# Altium schematic sheet top.SchDoc: uSDR schematic
size Letter; Author: Ye-sheng Kuo; CompanyName: Univ. of Michigan; DrawnBy: Ye-sheng Kuo; Revision: 2.0; SheetNumber: 1; SheetTotal: 16
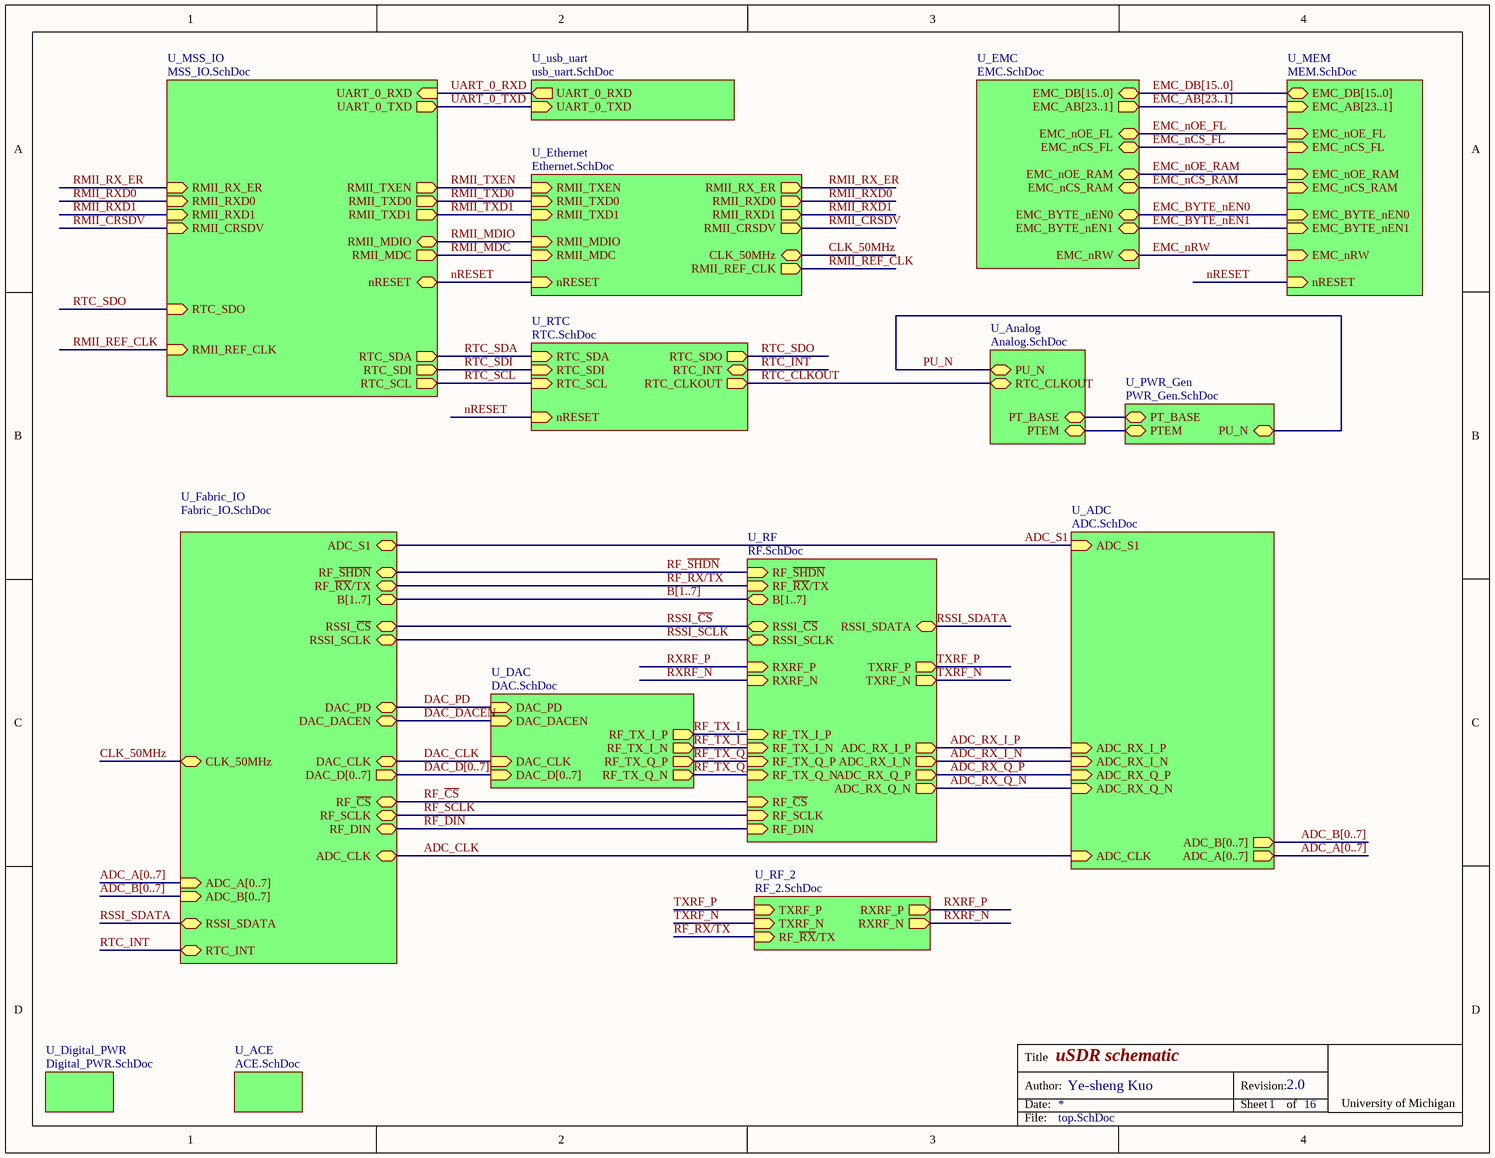
[diagram p0: top.SchDoc]

## Sub-sheets
U_ACE = ACE.SchDoc: no entries
U_ADC = ADC.SchDoc: ADC_CLK (in), ADC_A[0..7] (out), ADC_B[0..7] (out), ADC_RX_Q_P (in), ADC_RX_Q_N (in), ADC_RX_I_N (in), ADC_RX_I_P (in), ADC_S1 (in)
U_Analog = Analog.SchDoc: PU_N, PT_BASE, PTEM, RTC_CLKOUT
U_DAC = DAC.SchDoc: DAC_D[0..7] (in), DAC_CLK (in), DAC_DACEN (in), DAC_PD (in), RF_TX_I_P (out), RF_TX_I_N (out), RF_TX_Q_P (out), RF_TX_Q_N (out)
U_Digital_PWR = Digital_PWR.SchDoc: no entries
U_EMC = EMC.SchDoc: EMC_AB[23..1] (out), EMC_DB[15..0] (bidir), EMC_nOE_FL (bidir), EMC_nOE_RAM (bidir), EMC_nRW (bidir), EMC_nCS_FL (bidir), EMC_nCS_RAM (bidir), EMC_BYTE_nEN1 (bidir), EMC_BYTE_nEN0 (bidir)
U_Ethernet = Ethernet.SchDoc: RMII_TXD0 (in), RMII_TXD1 (in), RMII_RXD0 (out), RMII_RXD1 (out), RMII_CRSDV (out), RMII_RX_ER (out), RMII_MDIO (in), RMII_MDC (in), nRESET (in), RMII_TXEN (in), CLK_50MHz (bidir), RMII_REF_CLK (out)
U_Fabric_IO = Fabric_IO.SchDoc: DAC_D[0..7] (out), DAC_CLK (bidir), ADC_CLK (bidir), RF_SCLK (bidir), RF_DIN (bidir), CLK_50MHz (bidir), RF_~{CS} (bidir), ADC_A[0..7] (in), ADC_B[0..7] (in), DAC_PD (bidir), DAC_DACEN (bidir), RF_~{RX}/TX (bidir), ADC_S1 (bidir), RF_~{SHDN} (bidir), B[1..7] (bidir), RSSI_SCLK (bidir), RSSI_~{CS} (bidir), RSSI_SDATA (bidir), RTC_INT (bidir)
U_MEM = MEM.SchDoc: EMC_nCS_RAM (in), EMC_nRW (in), EMC_nOE_RAM (in), EMC_BYTE_nEN1 (in), EMC_BYTE_nEN0 (in), EMC_nOE_FL (in), EMC_nCS_FL (in), EMC_AB[23..1] (in), EMC_DB[15..0] (bidir), nRESET (in)
U_MSS_IO = MSS_IO.SchDoc: UART_0_RXD (in), UART_0_TXD (out), nRESET (bidir), RMII_TXD0 (out), RMII_TXD1 (out), RMII_RXD0 (in), RMII_RXD1 (in), RMII_RX_ER (in), RMII_MDIO (bidir), RMII_MDC (out), RMII_TXEN (out), RMII_CRSDV (in), RMII_REF_CLK (in), RTC_SDI (out), RTC_SDO (in), RTC_SCL (out), RTC_SDA (out)
U_PWR_Gen = PWR_Gen.SchDoc: PTEM, PT_BASE, PU_N
U_RF = RF.SchDoc: RF_~{SHDN} (in), RF_~{CS} (in), RF_SCLK (in), RF_DIN (in), ADC_RX_Q_N (out), RF_~{RX}/TX (in), RF_TX_I_P (in), RF_TX_I_N (in), RF_TX_Q_P (in), RF_TX_Q_N (in), ADC_RX_I_P (out), ADC_RX_I_N (out), ADC_RX_Q_P (out), RXRF_N (in), RXRF_P (in), TXRF_P (out), TXRF_N (out), RSSI_~{CS} (bidir), RSSI_SDATA (bidir), RSSI_SCLK (bidir), B[1..7] (bidir)
U_RF_2 = RF_2.SchDoc: RF_~{RX}/TX (in), TXRF_N (in), TXRF_P (in), RXRF_P (out), RXRF_N (out)
U_RTC = RTC.SchDoc: RTC_SDA (in), RTC_SDO (out), RTC_SDI (in), RTC_SCL (in), RTC_INT (bidir), RTC_CLKOUT, nRESET (in)
U_usb_uart = usb_uart.SchDoc: UART_0_TXD (in), UART_0_RXD (out)

## Nets
ADC_CLK: sheet U_Fabric_IO/ADC_CLK, sheet U_ADC/ADC_CLK
ADC_RX_I_N: sheet U_ADC/ADC_RX_I_N, sheet U_RF/ADC_RX_I_N
ADC_RX_I_P: sheet U_ADC/ADC_RX_I_P, sheet U_RF/ADC_RX_I_P
ADC_RX_Q_N: sheet U_ADC/ADC_RX_Q_N, sheet U_RF/ADC_RX_Q_N
ADC_RX_Q_P: sheet U_ADC/ADC_RX_Q_P, sheet U_RF/ADC_RX_Q_P
ADC_S1: sheet U_Fabric_IO/ADC_S1, sheet U_ADC/ADC_S1
CLK_50MHz: sheet U_Fabric_IO/CLK_50MHz, sheet U_Ethernet/CLK_50MHz
DAC_CLK: sheet U_Fabric_IO/DAC_CLK, sheet U_DAC/DAC_CLK
DAC_DACEN: sheet U_Fabric_IO/DAC_DACEN, sheet U_DAC/DAC_DACEN
DAC_PD: sheet U_Fabric_IO/DAC_PD, sheet U_DAC/DAC_PD
EMC_BYTE_nEN0: sheet U_EMC/EMC_BYTE_nEN0, sheet U_MEM/EMC_BYTE_nEN0
EMC_BYTE_nEN1: sheet U_EMC/EMC_BYTE_nEN1, sheet U_MEM/EMC_BYTE_nEN1
EMC_nCS_FL: sheet U_EMC/EMC_nCS_FL, sheet U_MEM/EMC_nCS_FL
EMC_nCS_RAM: sheet U_EMC/EMC_nCS_RAM, sheet U_MEM/EMC_nCS_RAM
EMC_nOE_FL: sheet U_EMC/EMC_nOE_FL, sheet U_MEM/EMC_nOE_FL
EMC_nOE_RAM: sheet U_EMC/EMC_nOE_RAM, sheet U_MEM/EMC_nOE_RAM
EMC_nRW: sheet U_EMC/EMC_nRW, sheet U_MEM/EMC_nRW
nRESET: sheet U_MEM/nRESET, sheet U_MSS_IO/nRESET, sheet U_Ethernet/nRESET, sheet U_RTC/nRESET
PU_N: sheet U_Analog/PU_N, sheet U_PWR_Gen/PU_N
RF_~{CS}: sheet U_Fabric_IO/RF_~{CS}, sheet U_RF/RF_~{CS}
RF_DIN: sheet U_Fabric_IO/RF_DIN, sheet U_RF/RF_DIN
RF_~{RX}/TX: sheet U_Fabric_IO/RF_~{RX}/TX, sheet U_RF/RF_~{RX}/TX, sheet U_RF_2/RF_~{RX}/TX
RF_~{SHDN}: sheet U_Fabric_IO/RF_~{SHDN}, sheet U_RF/RF_~{SHDN}
RF_SCLK: sheet U_Fabric_IO/RF_SCLK, sheet U_RF/RF_SCLK
RF_TX_I_N: sheet U_DAC/RF_TX_I_N, sheet U_RF/RF_TX_I_N
RF_TX_I_P: sheet U_DAC/RF_TX_I_P, sheet U_RF/RF_TX_I_P
RF_TX_Q_N: sheet U_DAC/RF_TX_Q_N, sheet U_RF/RF_TX_Q_N
RF_TX_Q_P: sheet U_DAC/RF_TX_Q_P, sheet U_RF/RF_TX_Q_P
RMII_CRSDV: sheet U_MSS_IO/RMII_CRSDV, sheet U_Ethernet/RMII_CRSDV
RMII_MDC: sheet U_MSS_IO/RMII_MDC, sheet U_Ethernet/RMII_MDC
RMII_MDIO: sheet U_MSS_IO/RMII_MDIO, sheet U_Ethernet/RMII_MDIO
RMII_REF_CLK: sheet U_MSS_IO/RMII_REF_CLK, sheet U_Ethernet/RMII_REF_CLK
RMII_RX_ER: sheet U_MSS_IO/RMII_RX_ER, sheet U_Ethernet/RMII_RX_ER
RMII_RXD0: sheet U_MSS_IO/RMII_RXD0, sheet U_Ethernet/RMII_RXD0
RMII_RXD1: sheet U_MSS_IO/RMII_RXD1, sheet U_Ethernet/RMII_RXD1
RMII_TXD0: sheet U_MSS_IO/RMII_TXD0, sheet U_Ethernet/RMII_TXD0
RMII_TXD1: sheet U_MSS_IO/RMII_TXD1, sheet U_Ethernet/RMII_TXD1
RMII_TXEN: sheet U_MSS_IO/RMII_TXEN, sheet U_Ethernet/RMII_TXEN
RSSI_~{CS}: sheet U_Fabric_IO/RSSI_~{CS}, sheet U_RF/RSSI_~{CS}
RSSI_SCLK: sheet U_Fabric_IO/RSSI_SCLK, sheet U_RF/RSSI_SCLK
RSSI_SDATA: sheet U_Fabric_IO/RSSI_SDATA, sheet U_RF/RSSI_SDATA
RTC_CLKOUT: sheet U_Analog/RTC_CLKOUT, sheet U_RTC/RTC_CLKOUT
RTC_INT: sheet U_Fabric_IO/RTC_INT, sheet U_RTC/RTC_INT
RTC_SCL: sheet U_MSS_IO/RTC_SCL, sheet U_RTC/RTC_SCL
RTC_SDA: sheet U_MSS_IO/RTC_SDA, sheet U_RTC/RTC_SDA
RTC_SDI: sheet U_MSS_IO/RTC_SDI, sheet U_RTC/RTC_SDI
RTC_SDO: sheet U_MSS_IO/RTC_SDO, sheet U_RTC/RTC_SDO
RXRF_N: sheet U_RF/RXRF_N, sheet U_RF_2/RXRF_N
RXRF_P: sheet U_RF/RXRF_P, sheet U_RF_2/RXRF_P
TXRF_N: sheet U_RF/TXRF_N, sheet U_RF_2/TXRF_N
TXRF_P: sheet U_RF/TXRF_P, sheet U_RF_2/TXRF_P
UART_0_RXD: sheet U_usb_uart/UART_0_RXD, sheet U_MSS_IO/UART_0_RXD
UART_0_TXD: sheet U_usb_uart/UART_0_TXD, sheet U_MSS_IO/UART_0_TXD
(unnamed): sheet U_Analog/PT_BASE, sheet U_PWR_Gen/PT_BASE
(unnamed): sheet U_Analog/PTEM, sheet U_PWR_Gen/PTEM

## Buses and harness runs
bus ADC_A[0..7] = sheet U_ADC/ADC_A[0..7]
bus ADC_A[0..7] = sheet U_Fabric_IO/ADC_A[0..7]
bus ADC_B[0..7] = sheet U_ADC/ADC_B[0..7]
bus ADC_B[0..7] = sheet U_Fabric_IO/ADC_B[0..7]
bus B[1..7] = sheet U_Fabric_IO/B[1..7] = sheet U_RF/B[1..7]
bus DAC_D[0..7] = sheet U_DAC/DAC_D[0..7] = sheet U_Fabric_IO/DAC_D[0..7]
bus EMC_AB[23..1] = sheet U_EMC/EMC_AB[23..1] = sheet U_MEM/EMC_AB[23..1]
bus EMC_DB[15..0] = sheet U_EMC/EMC_DB[15..0] = sheet U_MEM/EMC_DB[15..0]

## Notes on the sheet
- Title
- Date:
- Author:
- Revision:
- Sheet
- of
- University of Michigan
- File: